# EAGLE schematic main (EAGLE 7.7.0)
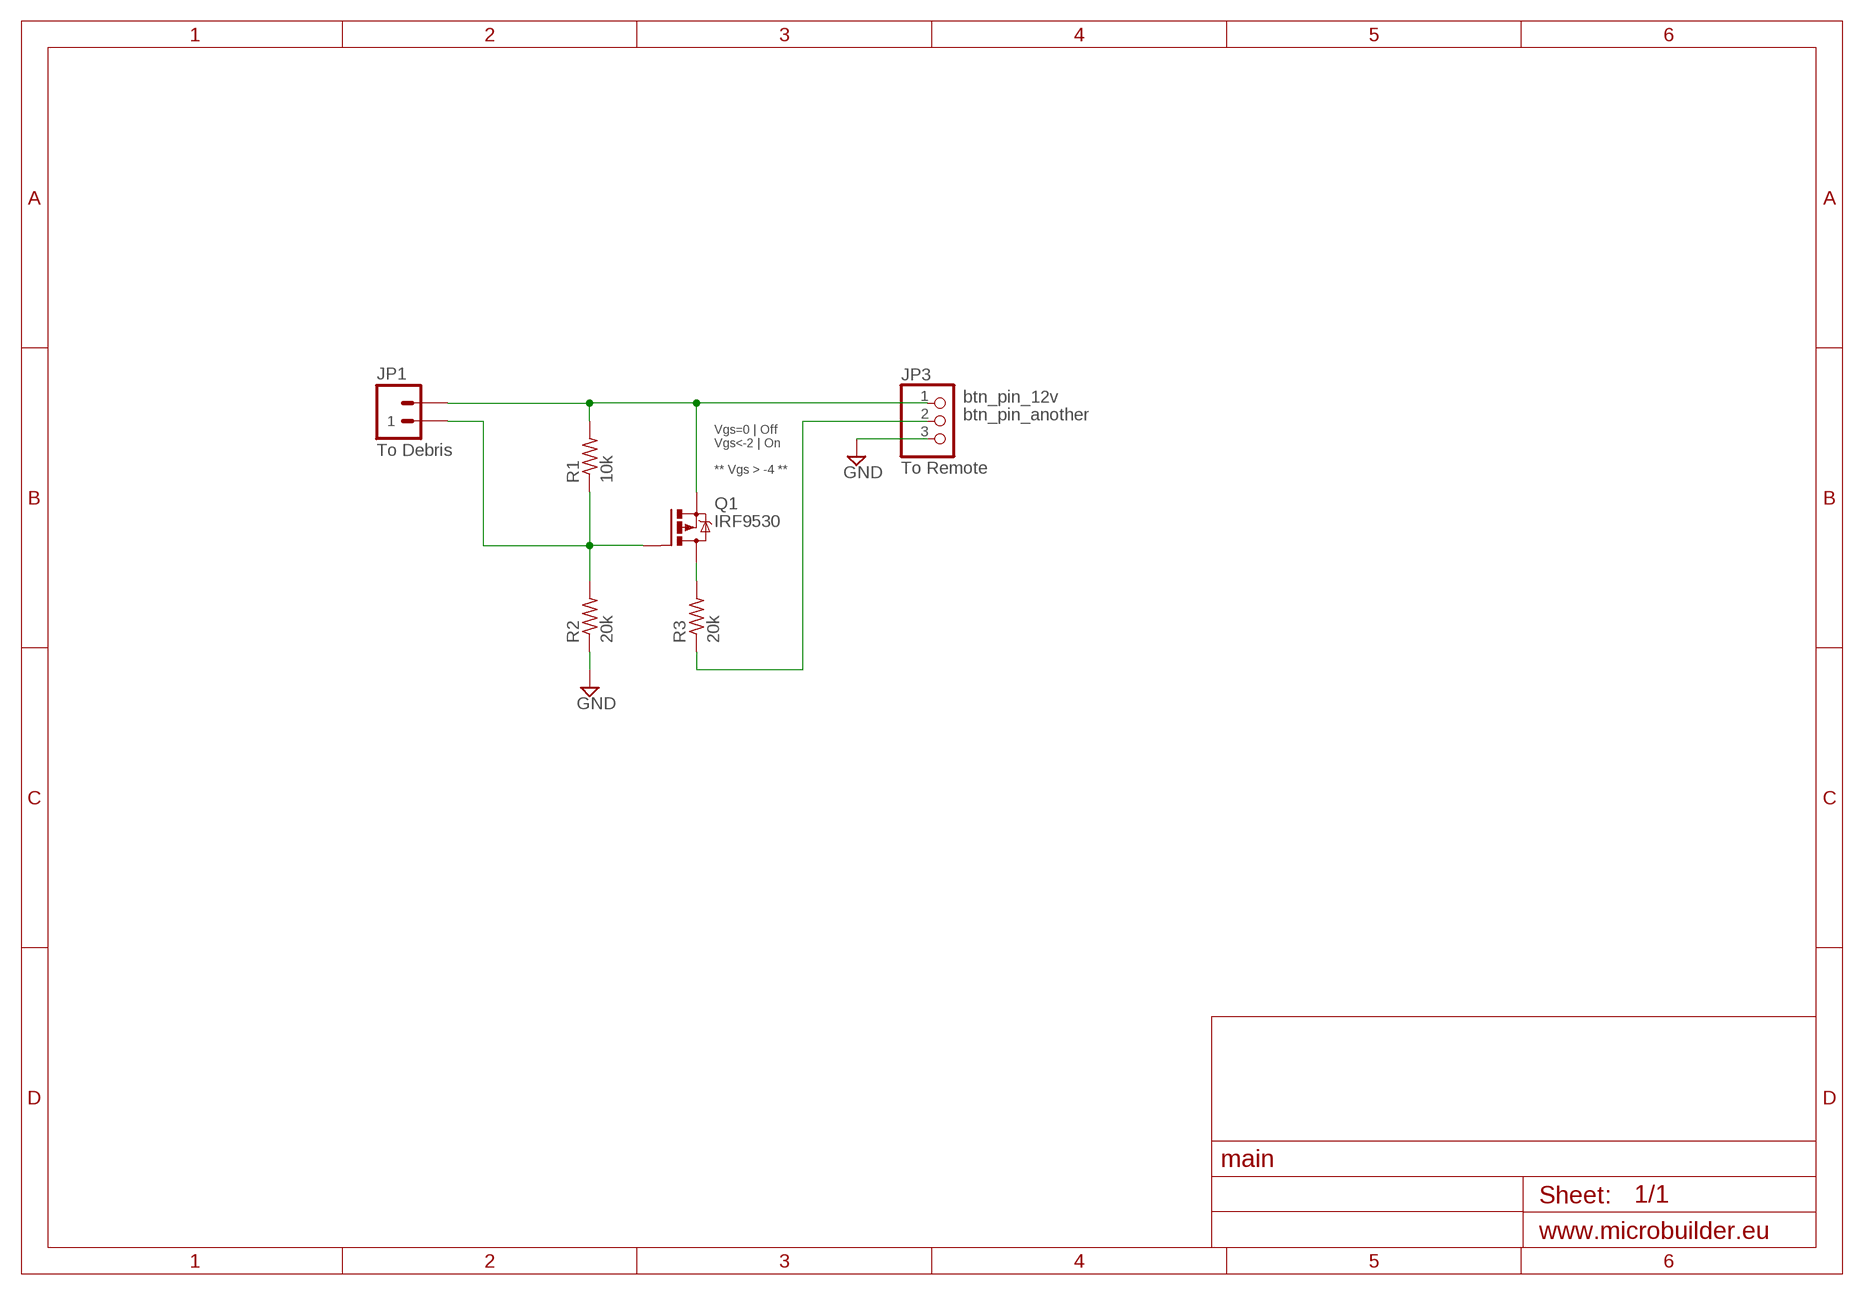
[diagram p0: schematic, sheet 1]

## Parts
JP1  To Debris  M02PTH  [1X02]
JP3  To Remote  HEADER-1X3  [1X03_OVAL]
Q1  IRF9530  [TO220BV]
R1  10k  RCL_R-US0204/5  [RCL_0204/5]
R2  20k  RCL_R-US0204/5  [RCL_0204/5]
R3  20k  RCL_R-US0204/5  [RCL_0204/5]

## Nets
GND: JP3.3 R2.1
N$1: Q1.D R3.2
N$2: JP1.2 JP3.1 Q1.S R1.2
N$3: JP1.1 Q1.G R1.1 R2.2
N$4: JP3.2 R3.1

## Notes on the sheet
- btn_pin_12v
- btn_pin_another
- Vgs=0 | Off
  Vgs<-2 | On
  
  ** Vgs > -4 **

## Library data of the parts
JP1 = ipas:M02: Header 2 Standard 2-pin 0.1" header. Use with straight break away headers (SKU : PRT-00116), right angle break away headers (PRT-00553), swiss pins (PRT-00743), machine pins (PRT-00117), and female headers (PRT-00115). Molex polarized connector foot print use with SKU : PRT-08233 with associated crimp pins and housings.
JP3 = microbuilder:HEADER-1X3: PIN HEADER
Q1 = ipas:IRF9530: P-CHANNEL HEXFET POWER-MOS-FET Source: http://www.irf.com/product-info/datasheets/data/irf9530.pdf
R1-R3 = ipas:RCL_R-US: RESISTOR, American symbol